# Altium schematic sheet Main_Schem.SchDoc
size A3; SheetNumber: 1; SheetTotal: 4
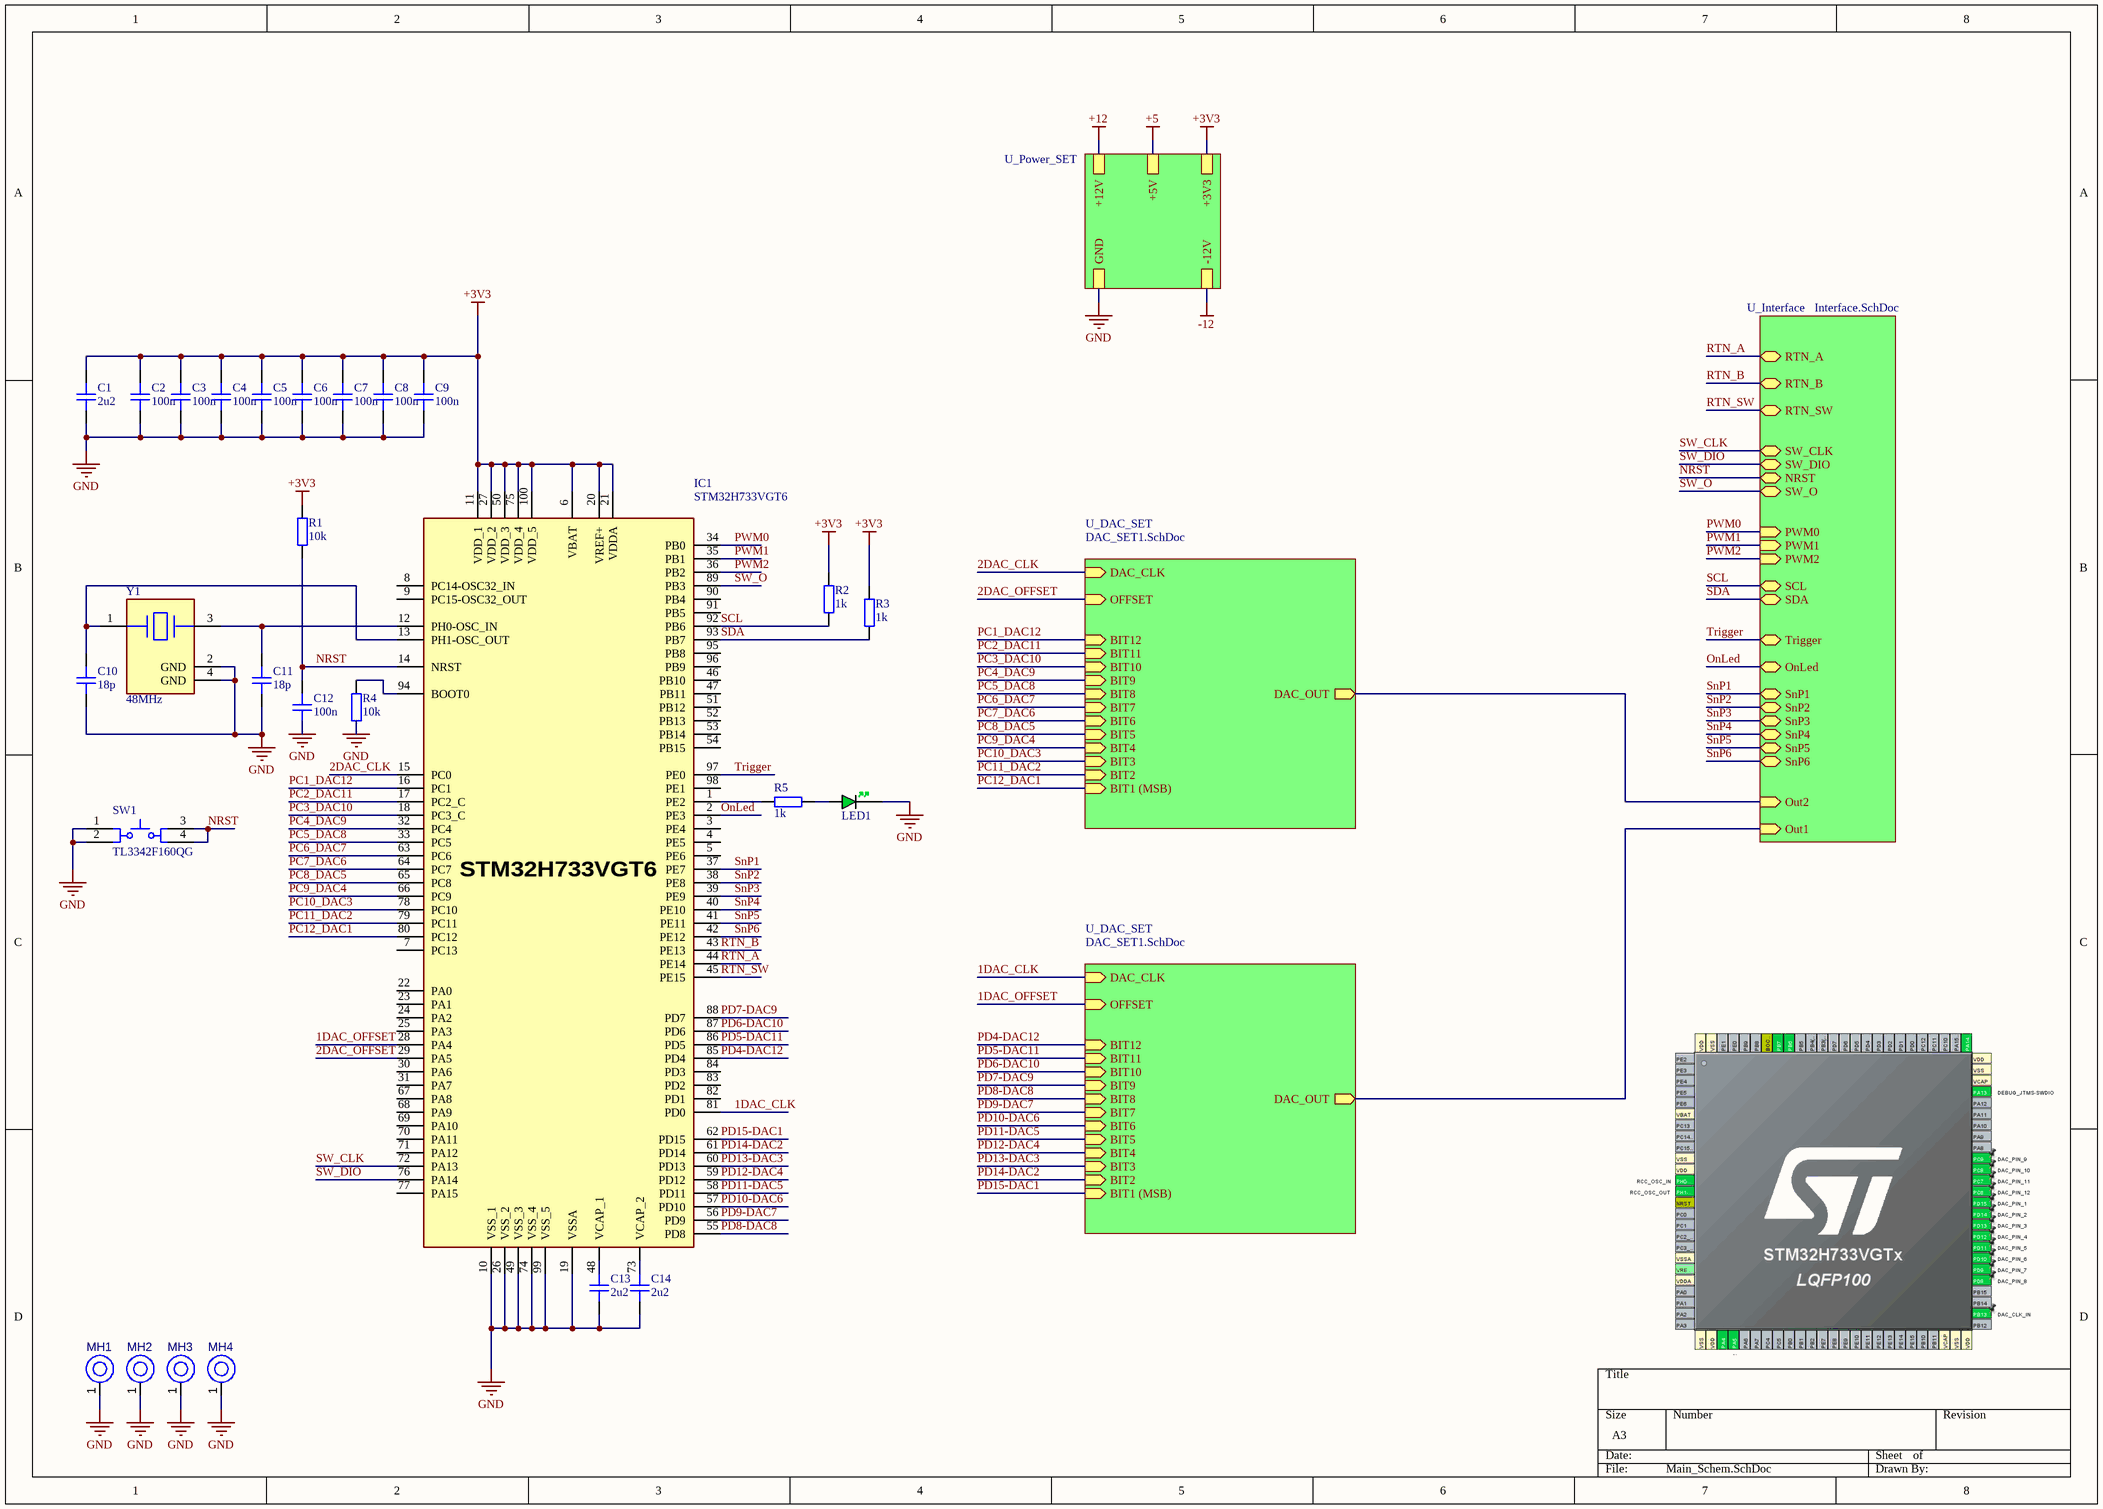
[diagram p0: Main_Schem.SchDoc]

## Parts
C1  2u2  [CAP_1206]
C2  100n  [CAP_0805]
C3  100n  [CAP_0805]
C4  100n  [CAP_0805]
C5  100n  [CAP_0805]
C6  100n  [CAP_0805]
C7  100n  [CAP_0805]
C8  100n  [CAP_0805]
C9  100n  [CAP_0805]
C10  18p  [CAP_0805]
C11  18p  [CAP_0805]
C12  100n  [CAP_0805]
C13  2u2  [CAP_1206]
C14  2u2  [CAP_1206]
IC1  STM32H733VGT6  [QFP50P1600X1600X160-100N]
LED1  GREEN  [LED_0805_GREEN]  (value not drawn)
R1  10k  [RES_0805]
R2  1k  [RES_0805]
R3  1k  [RES_0805]
R4  10k  [RES_0805]
R5  1k  [RES_0805]
SW1  TL3342F160QG  [ESWI-TL3342F160QG_V]
Y1  48MHz  [FP-ABM8-MFG]
ΜΗ1  PTH-M2D5X5  [PTH-M2D5X5]  (value not drawn)
ΜΗ2  PTH-M2D5X5  [PTH-M2D5X5]  (value not drawn)
ΜΗ3  PTH-M2D5X5  [PTH-M2D5X5]  (value not drawn)
ΜΗ4  PTH-M2D5X5  [PTH-M2D5X5]  (value not drawn)

## Sub-sheets
U_DAC_SET = DAC_SET1.SchDoc: BIT1 (MSB) (in), BIT2 (in), BIT3 (in), BIT4 (in), BIT5 (in), BIT6 (in), BIT7 (in), BIT8 (in), BIT9 (in), BIT10 (in), BIT11 (in), BIT12 (in), OFFSET (in), DAC_OUT (out), DAC_CLK (in)
U_DAC_SET = DAC_SET1.SchDoc: BIT1 (MSB) (in), BIT2 (in), BIT3 (in), BIT4 (in), BIT5 (in), BIT6 (in), BIT7 (in), BIT8 (in), BIT9 (in), BIT10 (in), BIT11 (in), BIT12 (in), OFFSET (in), DAC_OUT (out), DAC_CLK (in)
U_Interface = Interface.SchDoc: OnLed (bidir), Out1 (in), SnP1 (bidir), SnP2 (bidir), SnP3 (bidir), SnP4 (bidir), SnP5 (bidir), SnP6 (bidir), Trigger (bidir), SDA (bidir), SCL (bidir), Out2 (in), PWM0 (in), PWM1 (in), PWM2 (in), SW_CLK (bidir), SW_DIO (bidir), RTN_SW (bidir), RTN_B (bidir), RTN_A (bidir), NRST (bidir), SW_O (bidir)
U_Power_SET = Power_SET.SchDoc: +12V, -12V, +5V, +3V3, GND

## Nets
+3V3: C1.2 C2.2 C3.2 C4.2 C5.2 C6.2 C7.2 C8.2 C9.2 IC1.6(VBAT) IC1.11(VDD_1) IC1.20(VREF+) IC1.21(VDDA) IC1.27(VDD_2) IC1.50(VDD_3) IC1.75(VDD_4) IC1.100(VDD_5) R1.2 R2.1 R3.1 ; sheet U_Power_SET/+3V3
+5: sheet U_Power_SET/+5V
+12: sheet U_Power_SET/+12V
-12: sheet U_Power_SET/-12V
GND: C1.1 C2.1 C3.1 C4.1 C5.1 C6.1 C7.1 C8.1 C9.1 C10.1 C11.1 C12.1 C13.1 C14.1 IC1.10(VSS_1) IC1.19(VSSA) IC1.26(VSS_2) IC1.49(VSS_3) IC1.74(VSS_4) IC1.99(VSS_5) LED1.K R4.1 SW1.1 SW1.2 Y1.2(GND) Y1.4(GND) ΜΗ1.1(H1) ΜΗ2.1(H1) ΜΗ3.1(H1) ΜΗ4.1(H1) ; sheet U_Power_SET/GND
1DAC_CLK: IC1.81(PD0) ; sheet U_DAC_SET/DAC_CLK
1DAC_OFFSET: IC1.28(PA4) ; sheet U_DAC_SET/OFFSET
2DAC_CLK: IC1.15(PC0) ; sheet U_DAC_SET/DAC_CLK
2DAC_OFFSET: IC1.29(PA5) ; sheet U_DAC_SET/OFFSET
NRST: C12.2 IC1.14(NRST) R1.1 SW1.3 SW1.4 ; sheet U_Interface/NRST
OnLed: IC1.2(PE3) ; sheet U_Interface/OnLed
PC1_DAC12: IC1.16(PC1) ; sheet U_DAC_SET/BIT12
PC2_DAC11: IC1.17(PC2_C) ; sheet U_DAC_SET/BIT11
PC3_DAC10: IC1.18(PC3_C) ; sheet U_DAC_SET/BIT10
PC4_DAC9: IC1.32(PC4) ; sheet U_DAC_SET/BIT9
PC5_DAC8: IC1.33(PC5) ; sheet U_DAC_SET/BIT8
PC6_DAC7: IC1.63(PC6) ; sheet U_DAC_SET/BIT7
PC7_DAC6: IC1.64(PC7) ; sheet U_DAC_SET/BIT6
PC8_DAC5: IC1.65(PC8) ; sheet U_DAC_SET/BIT5
PC9_DAC4: IC1.66(PC9) ; sheet U_DAC_SET/BIT4
PC10_DAC3: IC1.78(PC10) ; sheet U_DAC_SET/BIT3
PC11_DAC2: IC1.79(PC11) ; sheet U_DAC_SET/BIT2
PC12_DAC1: IC1.80(PC12) ; sheet U_DAC_SET/BIT1 (MSB)
PD4-DAC12: IC1.85(PD4) ; sheet U_DAC_SET/BIT12
PD5-DAC11: IC1.86(PD5) ; sheet U_DAC_SET/BIT11
PD6-DAC10: IC1.87(PD6) ; sheet U_DAC_SET/BIT10
PD7-DAC9: IC1.88(PD7) ; sheet U_DAC_SET/BIT9
PD8-DAC8: IC1.55(PD8) ; sheet U_DAC_SET/BIT8
PD9-DAC7: IC1.56(PD9) ; sheet U_DAC_SET/BIT7
PD10-DAC6: IC1.57(PD10) ; sheet U_DAC_SET/BIT6
PD11-DAC5: IC1.58(PD11) ; sheet U_DAC_SET/BIT5
PD12-DAC4: IC1.59(PD12) ; sheet U_DAC_SET/BIT4
PD13-DAC3: IC1.60(PD13) ; sheet U_DAC_SET/BIT3
PD14-DAC2: IC1.61(PD14) ; sheet U_DAC_SET/BIT2
PD15-DAC1: IC1.62(PD15) ; sheet U_DAC_SET/BIT1 (MSB)
PWM0: IC1.34(PB0) ; sheet U_Interface/PWM0
PWM1: IC1.35(PB1) ; sheet U_Interface/PWM1
PWM2: IC1.36(PB2) ; sheet U_Interface/PWM2
RTN_A: IC1.44(PE14) ; sheet U_Interface/RTN_A
RTN_B: IC1.43(PE13) ; sheet U_Interface/RTN_B
RTN_SW: IC1.45(PE15) ; sheet U_Interface/RTN_SW
SCL: IC1.92(PB6) R2.2 ; sheet U_Interface/SCL
SDA: IC1.93(PB7) R3.2 ; sheet U_Interface/SDA
SnP1: IC1.37(PE7) ; sheet U_Interface/SnP1
SnP2: IC1.38(PE8) ; sheet U_Interface/SnP2
SnP3: IC1.39(PE9) ; sheet U_Interface/SnP3
SnP4: IC1.40(PE10) ; sheet U_Interface/SnP4
SnP5: IC1.41(PE11) ; sheet U_Interface/SnP5
SnP6: IC1.42(PE12) ; sheet U_Interface/SnP6
SW_CLK: IC1.72(PA13) ; sheet U_Interface/SW_CLK
SW_DIO: IC1.76(PA14) ; sheet U_Interface/SW_DIO
SW_O: IC1.89(PB3) ; sheet U_Interface/SW_O
Trigger: IC1.97(PE0) ; sheet U_Interface/Trigger
NetC10_2: C10.2 IC1.13(PH1-OSC_OUT) Y1.1
NetC11_2: C11.2 IC1.12(PH0-OSC_IN) Y1.3
NetC13_2: C13.2 IC1.48(VCAP_1)
NetC14_2: C14.2 IC1.73(VCAP_2)
NetIC1_1: IC1.1(PE2) R5.2
NetIC1_94: IC1.94(BOOT0) R4.2
NetLED1_A: LED1.A R5.1
(unnamed): sheet U_DAC_SET/DAC_OUT, sheet U_Interface/Out1
(unnamed): sheet U_Interface/Out2, sheet U_DAC_SET/DAC_OUT

Not connected (* = marked no-connect by the designer): IC1 3(PE4) 4(PE5) 5(PE6) 7(PC13) 8(PC14-OSC32_IN) 9(PC15-OSC32_OUT) 22(PA0) 23(PA1) 24(PA2) 25(PA3) 30(PA6) 31(PA7) 46(PB10) 47(PB11) 51(PB12) 52(PB13) 53(PB14) 54(PB15) 67(PA8) 68(PA9) 69(PA10) 70(PA11) 71(PA12) 77(PA15) 82(PD1) 83(PD2) 84(PD3) 90(PB4) 91(PB5) 95(PB8) 96(PB9) 98(PE1)

## Library data of the parts
C1 C13 C14 = CAP_1206: Capacitor SMD 1206; Manufacturer: *; Manufacturer Part Number: *; Distributor Link: *; LCSC: *; Rating: *; Dielectric: *
C2-C12 = CAP_0805: Capacitor SMD 0805; Manufacturer: *; Manufacturer Part Number: *; Distributor Link: *; LCSC: *; Rating: *; Dielectric: *
IC1 = CMP-020-00025-4: (550MHz), DAC
LED1 = LED_0805_GREEN: LED 0805 GREEN SMD; Manufacturer: *; Manufacturer Part Number: *; Distributor Link: *; LCSC: *
R1-R5 = RES_0805: Resistor SMD 0805; Manufacturer: *; Manufacturer Part Number: *; Distributor Link: *; LCSC: *
SW1 = CMP-011-00008-2: Tactile Switch, SPST-NO, 50 mA, 12 V, 4-Pin SMD, RoHS, Tape and Reel; Manufacturer: E-Switch; Operating Force: 1.6N; Current Rating: 50mA; Throw Configuration: SPST; Max Voltage Rating (DC): 12V; Datasheet URL: http://spec_sheets.e-switch.com/specs/P010632.pdf; Manufacturer URL: http://www.e-switch.ch/en/; Mounting Technology: SM; Case/Package: TL3342F160QG; Package Quantity: 3000; Contact Material: Silver; Package Description: 4-Pin Surface Mount Device, Body 5 x 5 mm, Pitch 6.3 mm; Package Reference: TL3342F160QG; Datasheet Version: Rev. I, 12/2010; Voltage Rating (DC): 12V; Contact Plating: Silver; RoHS Compliant: True; Packaging: TapeandReel
Y1 = CMP-27762-011708-1: Crystal 48MHz ±20ppm 18pF SMD-4 3.2mm x 2.5mm / ABM8-48.000MHZ-B2-T; Series Resistance: 35R; Frequency Stability: 50ppm; Package Quantity: 1000; Packaging: Tape and Reel; Mount: Surface Mount; Length: 3.2mm; Load Capacitance: 18pF; Max Operating Temperature: 70°C; Operating Frequency: 48 MHz; RoHS Compliant: Yes; Series: ABM8; Frequency Tolerance: 20ppm; Lead Free: Lead Free; Min Operating Temperature: -20°C; Case/Package: CSMD; Number of Pins: 4; Height: 0.031inch; ESR (Equivalent Series Resistance): 35R; Frequency: 48MHz; Radiation Hardening: No; Width: 0.098inch; Tolerance: 20ppm; Termination: SMD/SMT; Depth: 2.5mm; Resistor Type: Ceramic; REACH SVHC: No SVHC
ΜΗ1-ΜΗ4 = CMP-00028-00004-2: M2 PTH (2.5mm), 5mm pad; Pins: 1